# EAGLE schematic PoElli-Nucleo-mechanics (EAGLE 6.5.2)
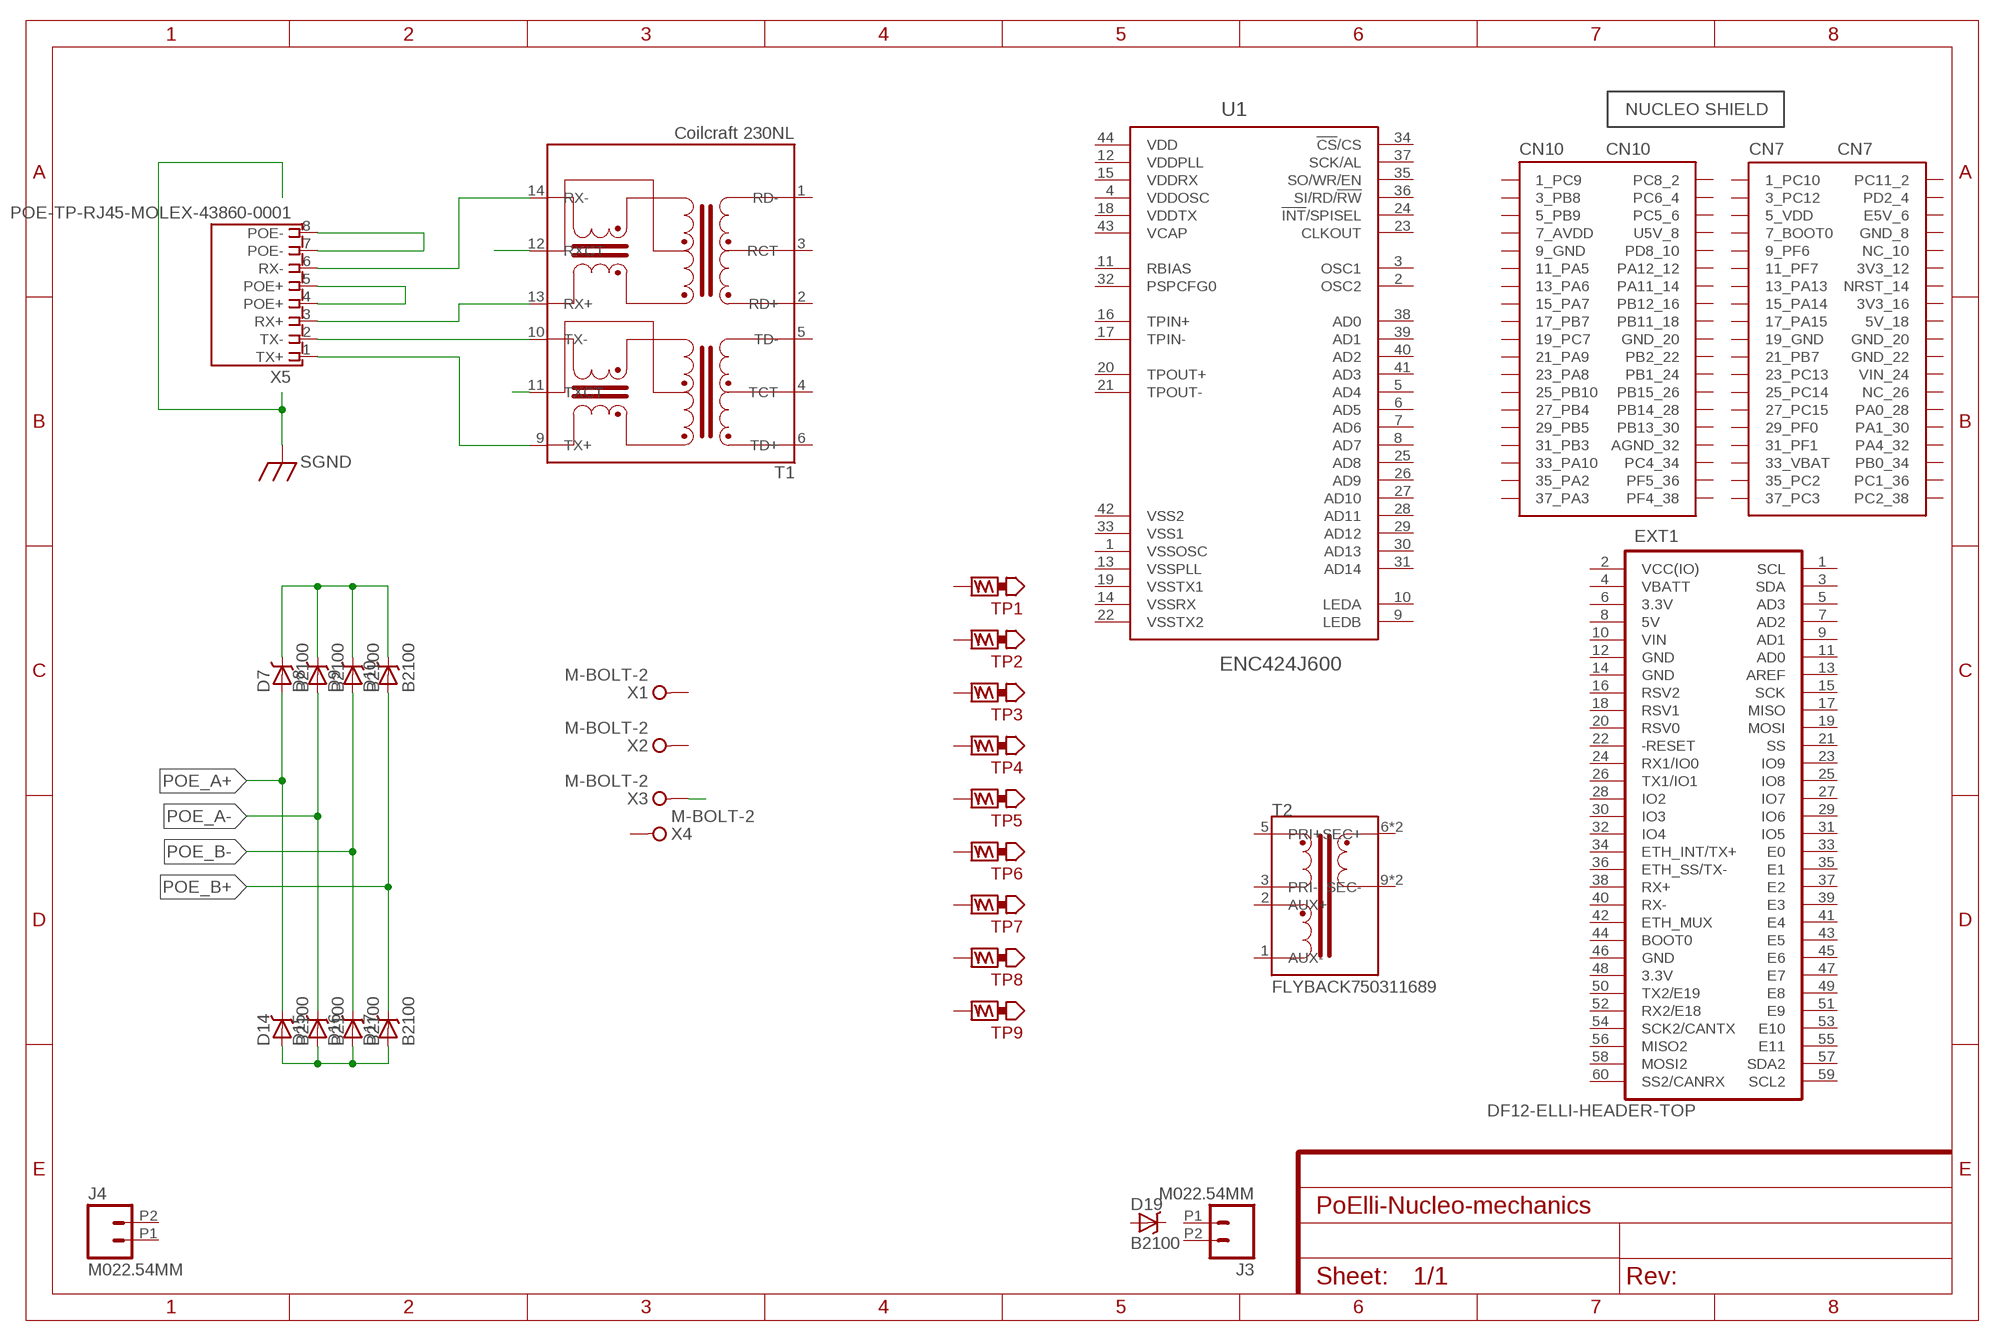
[diagram p0: schematic, sheet 1]

## Parts
CN7  NUCLEO-CN7  [NUCLEO-HEADER]
CN10  NUCLEO-CN10  [NUCLEO-HEADER]
D7  B2100  DIODE-SCHOTTKYB2100  [DIODE-B2100]
D8  B2100  DIODE-SCHOTTKYB2100  [DIODE-B2100]
D9  B2100  DIODE-SCHOTTKYB2100  [DIODE-B2100]
D10  B2100  DIODE-SCHOTTKYB2100  [DIODE-B2100]
D14  B2100  DIODE-SCHOTTKYB2100  [DIODE-B2100]
D15  B2100  DIODE-SCHOTTKYB2100  [DIODE-B2100]
D16  B2100  DIODE-SCHOTTKYB2100  [DIODE-B2100]
D17  B2100  DIODE-SCHOTTKYB2100  [DIODE-B2100]
D19  B2100  DIODE-SCHOTTKYB2100  [DIODE-B2100]
EXT1  DF12-ELLI-HEADER-TOP  [DF12(4.0)-60DP-0.5V]
J3  M022.54MM  M022.54MM_SCREWTERM  [1X02_2.54_SCREWTERM]
J4  M022.54MM  M022.54MM_SCREWTERM  [1X02_2.54_SCREWTERM]
NUCLEO  NUCLEO-SHIELD-OUTLINE-EXTENDED  [NUCLEO-SHIELD-UNDERSIDE-EXTENDED-OUTLINE]
T1  Coilcraft 230NL  POE-ISOLATION-230NL  [COILCRAFT-ETH1-230L]
T2  FLYBACK750311689  [WE_EP13_SMD_10PIN]
TP1  TEST_POINT-5000  [TP_5021]
TP2  TEST_POINT-5021  [TP_5000]
TP3  TEST_POINT-5021  [TP_5000]
TP4  TEST_POINT-5021  [TP_5000]
TP5  TEST_POINT-5000  [TP_5021]
TP6  TEST_POINT-5000  [TP_5021]
TP7  TEST_POINT-5000  [TP_5021]
TP8  TEST_POINT-5000  [TP_5021]
TP9  TEST_POINT-5000  [TP_5021]
U1  ENC424J600  [TQFP44-0.8MM]
X1  M-BOLT-2  [M2-1]
X2  M-BOLT-2  [M2-1]
X3  M-BOLT-2  [M2-1]
X4  M-BOLT-2  [M2-1]
X5  POE-TP-RJ45-MOLEX-43860-0001  [MOLEX-43860-0001]

## Nets
N$1: T1.10(TX-) X5.2(TX-)
N$2: T1.9(TX+) X5.1(TX+)
N$3: T1.13(RX+) X5.3(RX+)
N$4: T1.14(RX-) X5.6(RX-)
N$6: D7.C D8.C D9.C D10.C
N$8: D14.A D15.A D16.A D17.A
N$10: X5.7(POE-) X5.8(POE-)
N$13: T1.11(TXCT)
N$21: X3.1(KL1)
POE_A+: D7.A D14.C
POE_A-: D8.A D15.C T1.12(RXCT)
POE_B+: D10.A D17.C X5.4(POE+) X5.5(POE+)
POE_B-: D9.A D16.C
Unconnected: CN7.1(1_PC10) CN7.2(PC11_2) CN7.3(3_PC12) CN7.4(PD2_4) CN7.5(5_VDD) CN7.6(E5V_6) CN7.7(7_BOOT0) CN7.8(GND_8) CN7.9(9_PF6) CN7.10(NC_10) CN7.11(11_PF7) CN7.12(3V3_12) CN7.13(13_PA13) CN7.14(NRST_14) CN7.15(15_PA14) CN7.16(3V3_16) CN7.17(17_PA15) CN7.18(5V_18) CN7.19(19_GND) CN7.20(GND_20) CN7.21(21_PB7) CN7.22(GND_22) CN7.23(23_PC13) CN7.24(VIN_24) CN7.25(25_PC14) CN7.26(NC_26) CN7.27(27_PC15) CN7.28(PA0_28) CN7.29(29_PF0) CN7.30(PA1_30) CN7.31(31_PF1) CN7.32(PA4_32) CN7.33(33_VBAT) CN7.34(PB0_34) CN7.35(35_PC2) CN7.36(PC1_36) CN7.37(37_PC3) CN7.38(PC2_38) CN10.1(1_PC9) CN10.2(PC8_2) CN10.3(3_PB8) CN10.4(PC6_4) CN10.5(5_PB9) CN10.6(PC5_6) CN10.7(7_AVDD) CN10.8(U5V_8) CN10.9(9_GND) CN10.10(PD8_10) CN10.11(11_PA5) CN10.12(PA12_12) CN10.13(13_PA6) CN10.14(PA11_14) CN10.15(15_PA7) CN10.16(PB12_16) CN10.17(17_PB7) CN10.18(PB11_18) CN10.19(19_PC7) CN10.20(GND_20) CN10.21(21_PA9) CN10.22(PB2_22) CN10.23(23_PA8) CN10.24(PB1_24) CN10.25(25_PB10) CN10.26(PB15_26) CN10.27(27_PB4) CN10.28(PB14_28) CN10.29(29_PB5) CN10.30(PB13_30) CN10.31(31_PB3) CN10.32(AGND_32) CN10.33(33_PA10) CN10.34(PC4_34) CN10.35(35_PA2) CN10.36(PF5_36) CN10.37(37_PA3) CN10.38(PF4_38) D19.A D19.C EXT1.1(SCL) EXT1.3(SDA) EXT1.5(AD3) EXT1.7(AD2) EXT1.9(AD1) EXT1.11(AD0) EXT1.13(AREF) EXT1.15(SCK) EXT1.16(RSV2) EXT1.17(MISO) EXT1.18(RSV1) EXT1.19(MOSI) EXT1.20(RSV0) EXT1.21(SS) EXT1.22(-RESET) EXT1.23(IO9) EXT1.24(RX1/IO0) EXT1.25(IO8) EXT1.26(TX1/IO1) EXT1.27(IO7) EXT1.28(IO2) EXT1.29(IO6) EXT1.30(IO3) EXT1.31(IO5) EXT1.32(IO4) EXT1.33(E0) EXT1.34(ETH_INT/TX+) EXT1.35(E1) EXT1.36(ETH_SS/TX-) EXT1.37(E2) EXT1.38(RX+) EXT1.39(E3) EXT1.40(RX-) EXT1.41(E4) EXT1.42(ETH_MUX) EXT1.43(E5) EXT1.44(BOOT0) EXT1.45(E6) EXT1.46(GND) EXT1.47(E7) EXT1.48(3.3V) EXT1.49(E8) EXT1.50(TX2/E19) EXT1.51(E9) EXT1.52(RX2/E18) EXT1.53(E10) EXT1.54(SCK2/CANTX) EXT1.55(E11) EXT1.56(MISO2) EXT1.57(SDA2) EXT1.58(MOSI2) EXT1.59(SCL2) EXT1.60(SS2/CANRX) J3.P1 J3.P2 J4.P1 J4.P2 T1.1(RD-) T1.2(RD+) T1.3(RCT) T1.4(TCT) T1.5(TD-) T1.6(TD+) T2.1(AUX-) T2.2(AUX+) T2.3(PRI-) T2.5(PRI+) T2.6(SEC+) T2.7(SEC+) T2.9(SEC-) T2.10(SEC-) TP1.P$1 TP2.P$1 TP3.P$1 TP4.P$1 TP5.P$1 TP6.P$1 TP7.P$1 TP8.P$1 TP9.P$1 U1.2(OSC2) U1.3(OSC1) U1.5(AD4) U1.6(AD5) U1.7(AD6) U1.8(AD7) U1.9(LEDB) U1.10(LEDA) U1.11(RBIAS) U1.16(TPIN+) U1.17(TPIN-) U1.20(TPOUT+) U1.21(TPOUT-) U1.23(CLKOUT) U1.24(!INT!/SPISEL) U1.25(AD8) U1.26(AD9) U1.27(AD10) U1.28(AD11) U1.29(AD12) U1.30(AD13) U1.31(AD14) U1.32(PSPCFG0) U1.34(!CS!/CS) U1.35(SO/WR/EN) U1.36(SI/RD/!RW) U1.37(SCK/AL) U1.38(AD0) U1.39(AD1) U1.40(AD2) U1.41(AD3) X1.1(KL1) X2.1(KL1) X4.1(KL1)

## Power pins joined to a net without a drawn wire
3.3V: EXT1.6(3.3V)
5V: EXT1.8(5V)
GND: EXT1.12(GND) EXT1.14(GND)
VBATT: EXT1.4(VBATT)
VCAP: U1.43(VCAP)
VCC(IO): EXT1.2(VCC(IO))
VDD: U1.44(VDD)
VDDOSC: U1.4(VDDOSC)
VDDPLL: U1.12(VDDPLL)
VDDRX: U1.15(VDDRX)
VDDTX: U1.18(VDDTX)
VIN: EXT1.10(VIN)
VSS1: U1.33(VSS1)
VSS2: U1.42(VSS2)
VSSOSC: U1.1(VSSOSC)
VSSPLL: U1.13(VSSPLL)
VSSRX: U1.14(VSSRX)
VSSTX1: U1.19(VSSTX1)
VSSTX2: U1.22(VSSTX2)

## Library data of the parts
CN7 = ELL-i-Boards:NUCLEO-CN7
CN10 = ELL-i-Boards:NUCLEO-CN10
D7-D10 D14-D17 D19 = ELL-i-DIscreteSemi:DIODE-SCHOTTKY: Schottky Diodes A Schottky diode has a low forward voltage drop and a very fast switching action. A normal silicon diode has a voltage drop between 0.6–0.7 volts, while a Schottky diode voltage drop is between approximately 0.15–0.45 volts. This lower voltage drop can provide higher switching speed and better system efficiency. Wikipedia article on Schottky diodes <https://en.wikipedia.org/wiki/Schottky_diode>
EXT1 = ELL-i-Connectors:DF12-ELLI-*
J3 J4 = SparkFun-Connectors:M02: Standard 2-pin 0.1" header. Use with - straight break away headers ( PRT-00116) - right angle break away headers (PRT-00553) - swiss pins (PRT-00743) - machine pins (PRT-00117) - female headers (PRT-00115) Molex polarized connector foot print use with: PRT-08233 with associated crimp pins and housings. 2.54_SCREWTERM for use with PRT-10571. 3.5mm Screw Terminal footprints for PRT-08084 5mm Screw Terminal footprints for use with PRT-08433
NUCLEO = ELL-i-Boards:NUCLEO-SHIELD-OUTLINE
T1 = ELL-i-Transformers:POE-ISOLATION: Power-over-Ethernet isolation transformers In twisted pair Ethernet networks, there is a 1500V isolation transformer between the network cable and the connected device. In Power-over-Ethernet devices, the transformer provides the extra function of allowing the DC power to be extracted from the cable-side center taps of the transformer. For high-power PoE, the transformer cable-side winding must be of thick enough wire (i.e. have low-enough resistance) to carry the DC current without warming up too much. Isolation transformers <https://en.wikipedia.org/wiki/Isolation_transformer> (general article) Power-over-Ethernet <https://en.wikipedia.org/wiki/Power_over_Ethernet> (general article)
T2 = ELL-i-Transformers:FLYBACK: Flyback SMPS transformer These types of transformers are often used in flyback and forward SMPS converters. The primary-side auxillary winding typically used to generate a 7-12 V auxillary voltage, which is used to generate the operating voltage (VCC) for the SMPS controller chip. The packages includes the ones used at various ELL-i boards.
TP1-TP9 = ELL-i-Passives:TEST_POINT: Used for easier attachment of measuring equipment. Has both test loops and bare copper area.
U1 = ELL-i-DigitalIC:ENC424J600: ENC424J600 The ENC424J600 and ENC624J600 are stand-alone, Fast Ethernet controllers with an industry standard Serial Peripheral Interface (SPI) or a flexible parallel interface. They are designed to serve as an Ethernet network interface for any microcontroller equipped with SPI or a standard parallel port Not reviewed. Datasheet <http://ww1.microchip.com/downloads/en/DeviceDoc/39935b.pdf>
X1-X4 = ELL-i-Connectors:M-BOLT: Metric bolt connector
X5 = ELL-i-Connectors:POE-TP: Twisted pair Power-over-Ethernet MDI connector This is an 8-pin female twisted pair Ethernet <https://en.wikipedia.org/wiki/Ethernet_over_twisted_pair> jack, either an RJ45 jack <https://en.wikipedia.org/wiki/Registered_jack#RJ45> or an TIA/EIA-568 <https://en.wikipedia.org/wiki/TIA/EIA-568-B> punchdown jack. These connector are common for Cat5, Cat5e, and Cat6 Ethernet cables. In the used symbol, the TX and RX pins are named according to the medium dependent interface <https://en.wikipedia.org/wiki/Medium_dependent_interface> or computer (non-switch) side order, i.e. transmit on pins 1 and 2 on pair 3 (green in T568A or orange in T568B) and receive on pins 3 and 6 on pair 2 (orange in T568A and green in T568B), and extra pairs according to the Power-over-Ethernet <https://en.wikipedia.org/wiki/Power_over_Ethernet> Mode B specification, i.e. pins 4–5 (pair 1) and 7–8 (pair 4) forming the sides of the 48V DC. Hence, this symbol has 6 pin names while having 8 pins: TX+, TX-, RX+, RX-, POE+ and POE-, where the POE+ and POE- may be reversed at the network side, always requiring a diode bridge. Please note that neither T568A nor T568B are de facto standards for residential or commercial data wiring. It is a choice the company terminating the wire makes. Most people use A as it is easier to remember. In terms of data integrity (does the data arrive without loss ) there is no difference between the two wiring standards. You select one wiring standard and maintain it. As long as you have a straight through jumper data will be transmitted without errors. The ELL-i recommendation is to use T568A.